# EAGLE schematic schema (EAGLE 9.6.2)
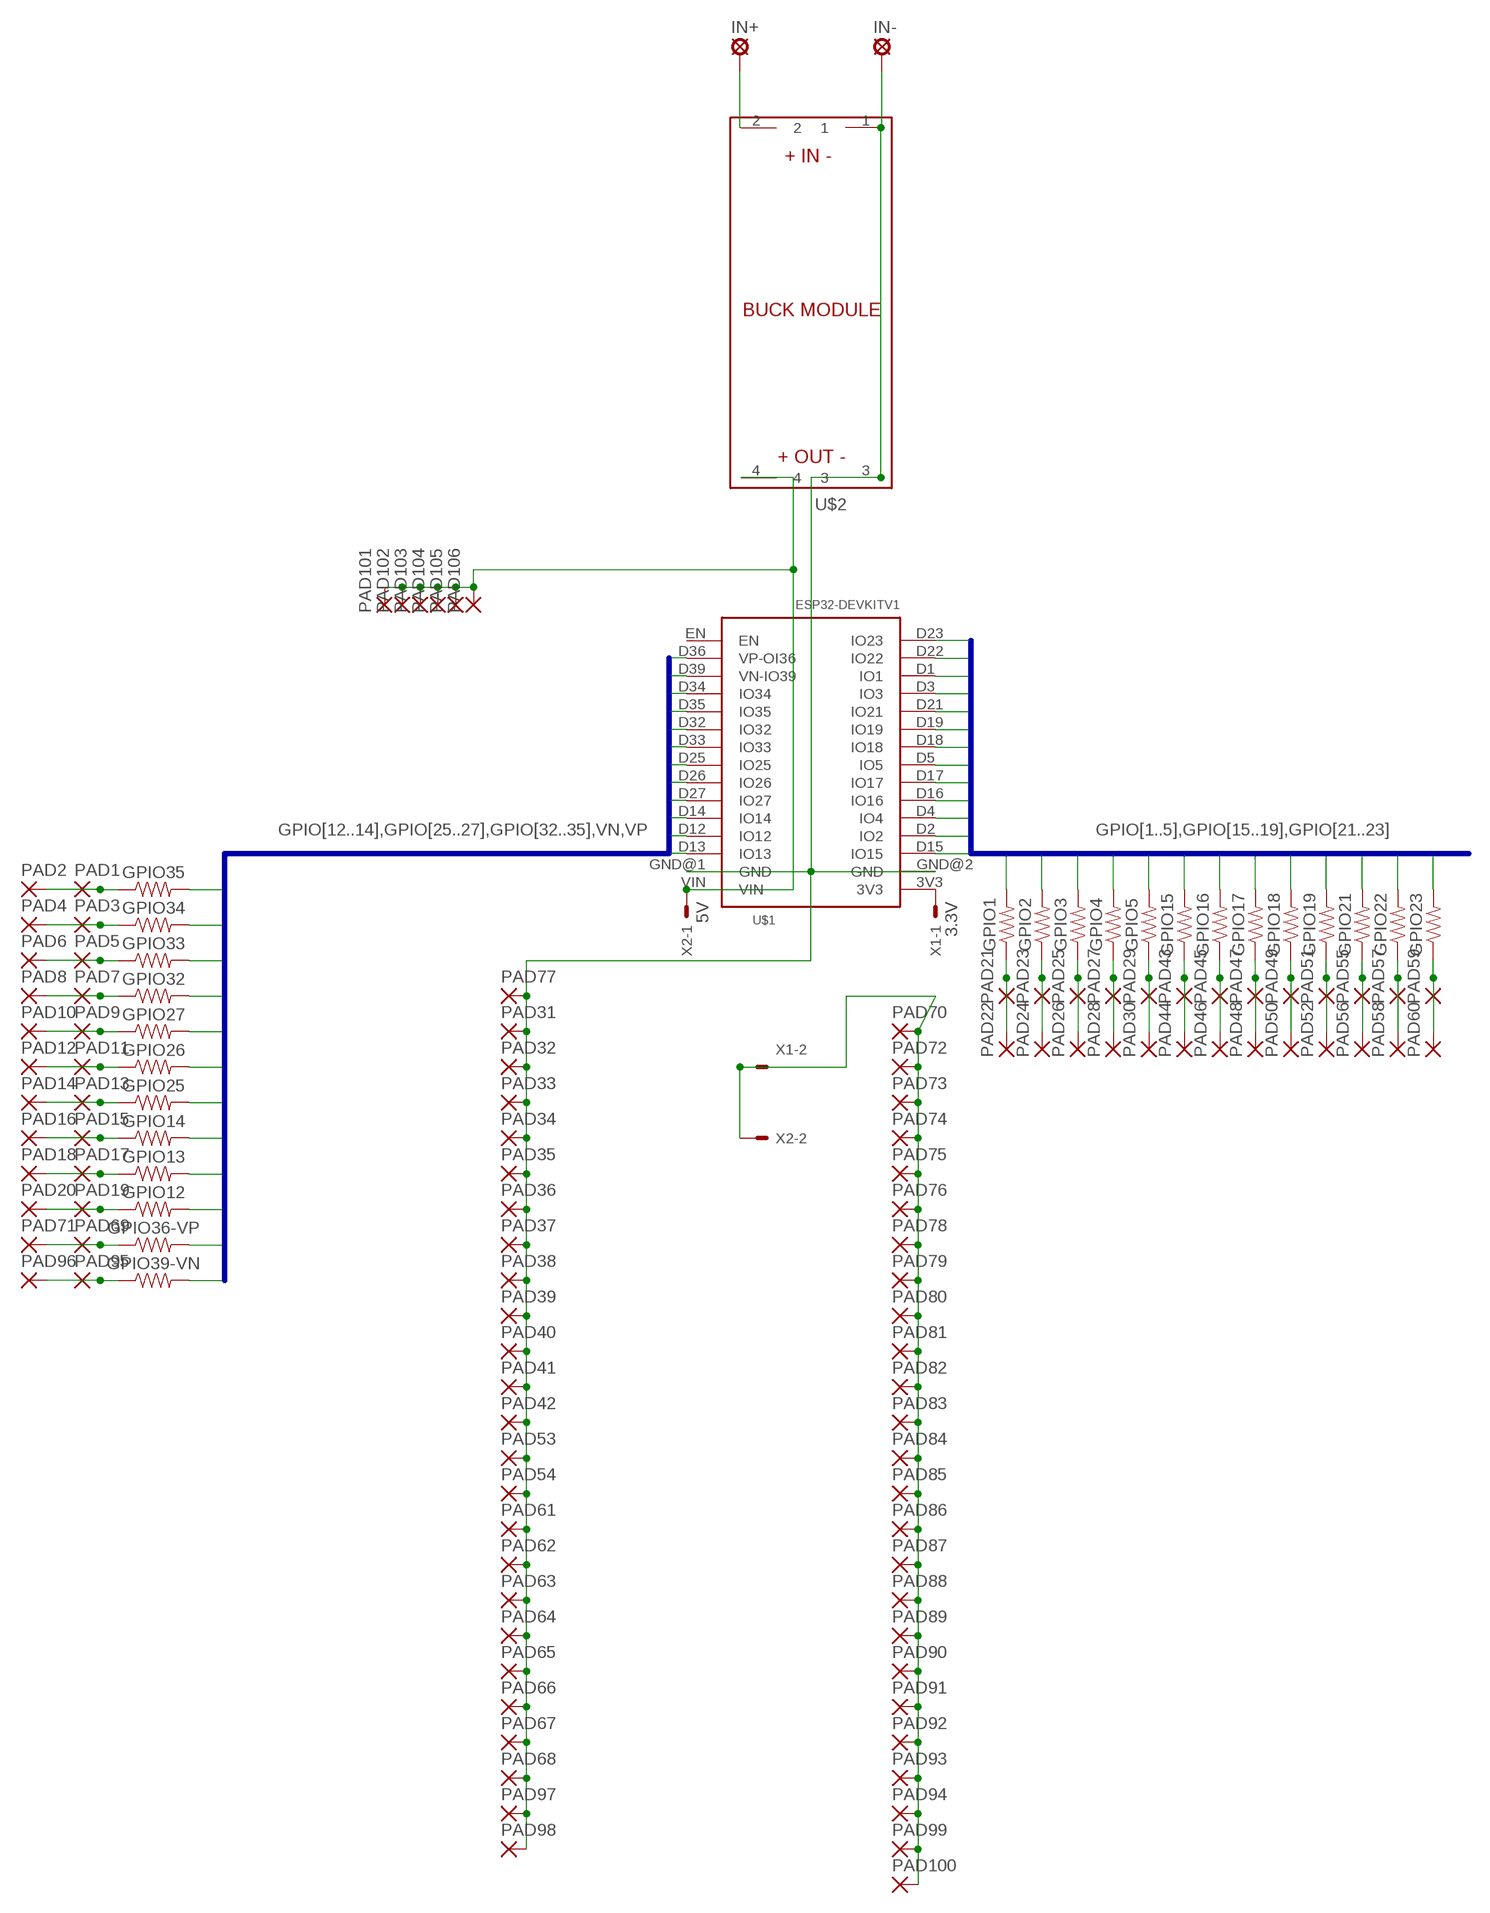
[diagram p0: schematic, sheet 1]

## Parts
GPIO1  RESISTORAXIAL-0.3-KIT  [AXIAL-0.3-KIT]
GPIO2  RESISTORAXIAL-0.3-KIT  [AXIAL-0.3-KIT]
GPIO3  RESISTORAXIAL-0.3-KIT  [AXIAL-0.3-KIT]
GPIO4  RESISTORAXIAL-0.3-KIT  [AXIAL-0.3-KIT]
GPIO5  RESISTORAXIAL-0.3-KIT  [AXIAL-0.3-KIT]
GPIO12  RESISTORAXIAL-0.3-KIT  [AXIAL-0.3-KIT]
GPIO13  RESISTORAXIAL-0.3-KIT  [AXIAL-0.3-KIT]
GPIO14  RESISTORAXIAL-0.3-KIT  [AXIAL-0.3-KIT]
GPIO15  RESISTORAXIAL-0.3-KIT  [AXIAL-0.3-KIT]
GPIO16  RESISTORAXIAL-0.3-KIT  [AXIAL-0.3-KIT]
GPIO17  RESISTORAXIAL-0.3-KIT  [AXIAL-0.3-KIT]
GPIO18  RESISTORAXIAL-0.3-KIT  [AXIAL-0.3-KIT]
GPIO19  RESISTORAXIAL-0.3-KIT  [AXIAL-0.3-KIT]
GPIO21  RESISTORAXIAL-0.3-KIT  [AXIAL-0.3-KIT]
GPIO22  RESISTORAXIAL-0.3-KIT  [AXIAL-0.3-KIT]
GPIO23  RESISTORAXIAL-0.3-KIT  [AXIAL-0.3-KIT]
GPIO25  RESISTORAXIAL-0.3-KIT  [AXIAL-0.3-KIT]
GPIO26  RESISTORAXIAL-0.3-KIT  [AXIAL-0.3-KIT]
GPIO27  RESISTORAXIAL-0.3-KIT  [AXIAL-0.3-KIT]
GPIO32  RESISTORAXIAL-0.3-KIT  [AXIAL-0.3-KIT]
GPIO33  RESISTORAXIAL-0.3-KIT  [AXIAL-0.3-KIT]
GPIO34  RESISTORAXIAL-0.3-KIT  [AXIAL-0.3-KIT]
GPIO35  RESISTORAXIAL-0.3-KIT  [AXIAL-0.3-KIT]
GPIO36-VP  RESISTORAXIAL-0.3-KIT  [AXIAL-0.3-KIT]
GPIO39-VN  RESISTORAXIAL-0.3-KIT  [AXIAL-0.3-KIT]
IN+  SE14  [SE14]
IN-  SE14  [SE14]
PAD1  2,54/1,1  [2,54/1,1]
PAD2  2,54/1,1  [2,54/1,1]
PAD3  2,54/1,1  [2,54/1,1]
PAD4  2,54/1,1  [2,54/1,1]
PAD5  2,54/1,1  [2,54/1,1]
PAD6  2,54/1,1  [2,54/1,1]
PAD7  2,54/1,1  [2,54/1,1]
PAD8  2,54/1,1  [2,54/1,1]
PAD9  2,54/1,1  [2,54/1,1]
PAD10  2,54/1,1  [2,54/1,1]
PAD11  2,54/1,1  [2,54/1,1]
PAD12  2,54/1,1  [2,54/1,1]
PAD13  2,54/1,1  [2,54/1,1]
PAD14  2,54/1,1  [2,54/1,1]
PAD15  2,54/1,1  [2,54/1,1]
PAD16  2,54/1,1  [2,54/1,1]
PAD17  2,54/1,1  [2,54/1,1]
PAD18  2,54/1,1  [2,54/1,1]
PAD19  2,54/1,1  [2,54/1,1]
PAD20  2,54/1,1  [2,54/1,1]
PAD21  2,54/1,1  [2,54/1,1]
PAD22  2,54/1,1  [2,54/1,1]
PAD23  2,54/1,1  [2,54/1,1]
PAD24  2,54/1,1  [2,54/1,1]
PAD25  2,54/1,1  [2,54/1,1]
PAD26  2,54/1,1  [2,54/1,1]
PAD27  2,54/1,1  [2,54/1,1]
PAD28  2,54/1,1  [2,54/1,1]
PAD29  2,54/1,1  [2,54/1,1]
PAD30  2,54/1,1  [2,54/1,1]
PAD31  2,54/1,1  [2,54/1,1]
PAD32  2,54/1,1  [2,54/1,1]
PAD33  2,54/1,1  [2,54/1,1]
PAD34  2,54/1,1  [2,54/1,1]
PAD35  2,54/1,1  [2,54/1,1]
PAD36  2,54/1,1  [2,54/1,1]
PAD37  2,54/1,1  [2,54/1,1]
PAD38  2,54/1,1  [2,54/1,1]
PAD39  2,54/1,1  [2,54/1,1]
PAD40  2,54/1,1  [2,54/1,1]
PAD41  2,54/1,1  [2,54/1,1]
PAD42  2,54/1,1  [2,54/1,1]
PAD43  2,54/1,1  [2,54/1,1]
PAD44  2,54/1,1  [2,54/1,1]
PAD45  2,54/1,1  [2,54/1,1]
PAD46  2,54/1,1  [2,54/1,1]
PAD47  2,54/1,1  [2,54/1,1]
PAD48  2,54/1,1  [2,54/1,1]
PAD49  2,54/1,1  [2,54/1,1]
PAD50  2,54/1,1  [2,54/1,1]
PAD51  2,54/1,1  [2,54/1,1]
PAD52  2,54/1,1  [2,54/1,1]
PAD53  2,54/1,1  [2,54/1,1]
PAD54  2,54/1,1  [2,54/1,1]
PAD55  2,54/1,1  [2,54/1,1]
PAD56  2,54/1,1  [2,54/1,1]
PAD57  2,54/1,1  [2,54/1,1]
PAD58  2,54/1,1  [2,54/1,1]
PAD59  2,54/1,1  [2,54/1,1]
PAD60  2,54/1,1  [2,54/1,1]
PAD61  2,54/1,1  [2,54/1,1]
PAD62  2,54/1,1  [2,54/1,1]
PAD63  2,54/1,1  [2,54/1,1]
PAD64  2,54/1,1  [2,54/1,1]
PAD65  2,54/1,1  [2,54/1,1]
PAD66  2,54/1,1  [2,54/1,1]
PAD67  2,54/1,1  [2,54/1,1]
PAD68  2,54/1,1  [2,54/1,1]
PAD69  2,54/1,1  [2,54/1,1]
PAD70  2,54/1,1  [2,54/1,1]
PAD71  2,54/1,1  [2,54/1,1]
PAD72  2,54/1,1  [2,54/1,1]
PAD73  2,54/1,1  [2,54/1,1]
PAD74  2,54/1,1  [2,54/1,1]
PAD75  2,54/1,1  [2,54/1,1]
PAD76  2,54/1,1  [2,54/1,1]
PAD77  2,54/1,1  [2,54/1,1]
PAD78  2,54/1,1  [2,54/1,1]
PAD79  2,54/1,1  [2,54/1,1]
PAD80  2,54/1,1  [2,54/1,1]
PAD81  2,54/1,1  [2,54/1,1]
PAD82  2,54/1,1  [2,54/1,1]
PAD83  2,54/1,1  [2,54/1,1]
PAD84  2,54/1,1  [2,54/1,1]
PAD85  2,54/1,1  [2,54/1,1]
PAD86  2,54/1,1  [2,54/1,1]
PAD87  2,54/1,1  [2,54/1,1]
PAD88  2,54/1,1  [2,54/1,1]
PAD89  2,54/1,1  [2,54/1,1]
PAD90  2,54/1,1  [2,54/1,1]
PAD91  2,54/1,1  [2,54/1,1]
PAD92  2,54/1,1  [2,54/1,1]
PAD93  2,54/1,1  [2,54/1,1]
PAD94  2,54/1,1  [2,54/1,1]
PAD95  2,54/1,1  [2,54/1,1]
PAD96  2,54/1,1  [2,54/1,1]
PAD97  2,54/1,1  [2,54/1,1]
PAD98  2,54/1,1  [2,54/1,1]
PAD99  2,54/1,1  [2,54/1,1]
PAD100  2,54/1,1  [2,54/1,1]
PAD101  2,54/1,1  [2,54/1,1]
PAD102  2,54/1,1  [2,54/1,1]
PAD103  2,54/1,1  [2,54/1,1]
PAD104  2,54/1,1  [2,54/1,1]
PAD105  2,54/1,1  [2,54/1,1]
PAD106  2,54/1,1  [2,54/1,1]
U$1  ESP32DEVKITV1  [ESP32-DEVKITV1]
U$2  BUCK_MODULEWITH_SMDPADS&THROUGHHOLES  [BUCK_MODULE]
X1  3.3V  22-23-2021  [22-23-2021]
X2  5V  22-23-2021  [22-23-2021]

## Nets
GPIO1: GPIO1.P$2 U$1.D1(IO1)
GPIO2: GPIO2.P$2 U$1.D2(IO2)
GPIO3: GPIO3.P$2 U$1.D3(IO3)
GPIO4: GPIO4.P$2 U$1.D4(IO4)
GPIO5: GPIO5.P$2 U$1.D5(IO5)
GPIO12: GPIO12.P$2 U$1.D12(IO12)
GPIO13: GPIO13.P$2 U$1.D13(IO13)
GPIO14: GPIO14.P$2 U$1.D14(IO14)
GPIO15: GPIO15.P$2 U$1.D15(IO15)
GPIO16: GPIO16.P$2 U$1.D16(IO16)
GPIO17: GPIO17.P$2 U$1.D17(IO17)
GPIO18: GPIO18.P$2 U$1.D18(IO18)
GPIO19: GPIO19.P$2 U$1.D19(IO19)
GPIO21: GPIO21.P$2 U$1.D21(IO21)
GPIO22: GPIO22.P$2 U$1.D22(IO22)
GPIO23: GPIO23.P$2 U$1.D23(IO23)
GPIO25: GPIO25.P$2 U$1.D25(IO25)
GPIO26: GPIO26.P$2 U$1.D26(IO26)
GPIO27: GPIO27.P$2 U$1.D27(IO27)
GPIO32: GPIO32.P$2 U$1.D32(IO32)
GPIO33: GPIO33.P$2 U$1.D33(IO33)
GPIO34: GPIO34.P$2 U$1.D34(IO34)
GPIO35: GPIO35.P$2 U$1.D35(IO35)
N$1: GPIO35.P$1 PAD1.1(P) PAD2.1(P)
N$2: GPIO34.P$1 PAD3.1(P) PAD4.1(P)
N$3: GPIO33.P$1 PAD5.1(P) PAD6.1(P)
N$4: GPIO32.P$1 PAD7.1(P) PAD8.1(P)
N$5: GPIO27.P$1 PAD9.1(P) PAD10.1(P)
N$6: GPIO26.P$1 PAD11.1(P) PAD12.1(P)
N$7: GPIO25.P$1 PAD13.1(P) PAD14.1(P)
N$8: GPIO14.P$1 PAD15.1(P) PAD16.1(P)
N$9: GPIO13.P$1 PAD17.1(P) PAD18.1(P)
N$10: GPIO12.P$1 PAD19.1(P) PAD20.1(P)
N$11: GPIO1.P$1 PAD21.1(P) PAD22.1(P)
N$12: GPIO2.P$1 PAD23.1(P) PAD24.1(P)
N$13: GPIO3.P$1 PAD25.1(P) PAD26.1(P)
N$14: GPIO4.P$1 PAD27.1(P) PAD28.1(P)
N$15: GPIO5.P$1 PAD29.1(P) PAD30.1(P)
N$16: PAD101.1(P) PAD102.1(P) PAD103.1(P) PAD104.1(P) PAD105.1(P) PAD106.1(P) U$1.VIN U$2.4 X2.1
N$17: IN-.MP PAD31.1(P) PAD32.1(P) PAD33.1(P) PAD34.1(P) PAD35.1(P) PAD36.1(P) PAD37.1(P) PAD38.1(P) PAD39.1(P) PAD40.1(P) PAD41.1(P) PAD42.1(P) PAD53.1(P) PAD54.1(P) PAD61.1(P) PAD62.1(P) PAD63.1(P) PAD64.1(P) PAD65.1(P) PAD66.1(P) PAD67.1(P) PAD68.1(P) PAD77.1(P) PAD97.1(P) PAD98.1(P) U$1.GND@1(GND) U$1.GND@2(GND) U$2.1 U$2.3
N$18: IN+.MP U$2.2
N$19: GPIO36-VP.P$1 PAD69.1(P) PAD71.1(P)
N$20: PAD70.1(P) PAD72.1(P) PAD73.1(P) PAD74.1(P) PAD75.1(P) PAD76.1(P) PAD78.1(P) PAD79.1(P) PAD80.1(P) PAD81.1(P) PAD82.1(P) PAD83.1(P) PAD84.1(P) PAD85.1(P) PAD86.1(P) PAD87.1(P) PAD88.1(P) PAD89.1(P) PAD90.1(P) PAD91.1(P) PAD92.1(P) PAD93.1(P) PAD94.1(P) PAD99.1(P) PAD100.1(P) X1.2 X2.2
N$21: GPIO39-VN.P$1 PAD95.1(P) PAD96.1(P)
N$22: GPIO15.P$1 PAD43.1(P) PAD44.1(P)
N$23: GPIO16.P$1 PAD45.1(P) PAD46.1(P)
N$24: GPIO17.P$1 PAD47.1(P) PAD48.1(P)
N$25: GPIO18.P$1 PAD49.1(P) PAD50.1(P)
N$26: GPIO19.P$1 PAD51.1(P) PAD52.1(P)
N$27: U$1.3V3 X1.1
N$28: GPIO21.P$1 PAD55.1(P) PAD56.1(P)
N$29: GPIO22.P$1 PAD57.1(P) PAD58.1(P)
N$30: GPIO23.P$1 PAD59.1(P) PAD60.1(P)
VN: GPIO39-VN.P$2 U$1.D39(VN-IO39)
VP: GPIO36-VP.P$2 U$1.D36(VP-OI36)
Unconnected: U$1.EN

## Buses
GPIO[12..14],GPIO[25..27],GPIO[32..35],VN,VP
GPIO[1..5],GPIO[15..19],GPIO[21..23]

## Library data of the parts
GPIO1-GPIO5 GPIO13-GPIO19 GPIO21-GPIO23 GPIO25-GPIO27 GPIO32-GPIO35 GPIO36-VP GPIO39-VN = SparkFun-Resistors:RESISTOR: Generic Resistor Package
GPIO12 = SparkFun-Resistors:RESISTOR: Generic Resistor Package; SPICEPREFIX: B
IN+ IN- = solpad:SE14: SOLDER PAD E1553, drill 1,4mm, distributor Buerklin, 07F820
PAD1-PAD18 PAD21-PAD106 = wirepad:2,54/1,1: THROUGH-HOLE PAD
PAD19 PAD20 = wirepad:2,54/1,1: THROUGH-HOLE PAD; SPICEPREFIX: X
U$1 = ESP32-DEVKITV1:ESP32DEVKITV1
U$2 = BUCK_MODULE:BUCK_MODULE
X1 X2 = con-molex:22-23-2021: .100" (2.54mm) Center Header - 2 Pin; MF: MOLEX; MPN: 22-23-2021; OC_FARNELL: 1462926; OC_NEWARK: 25C3832